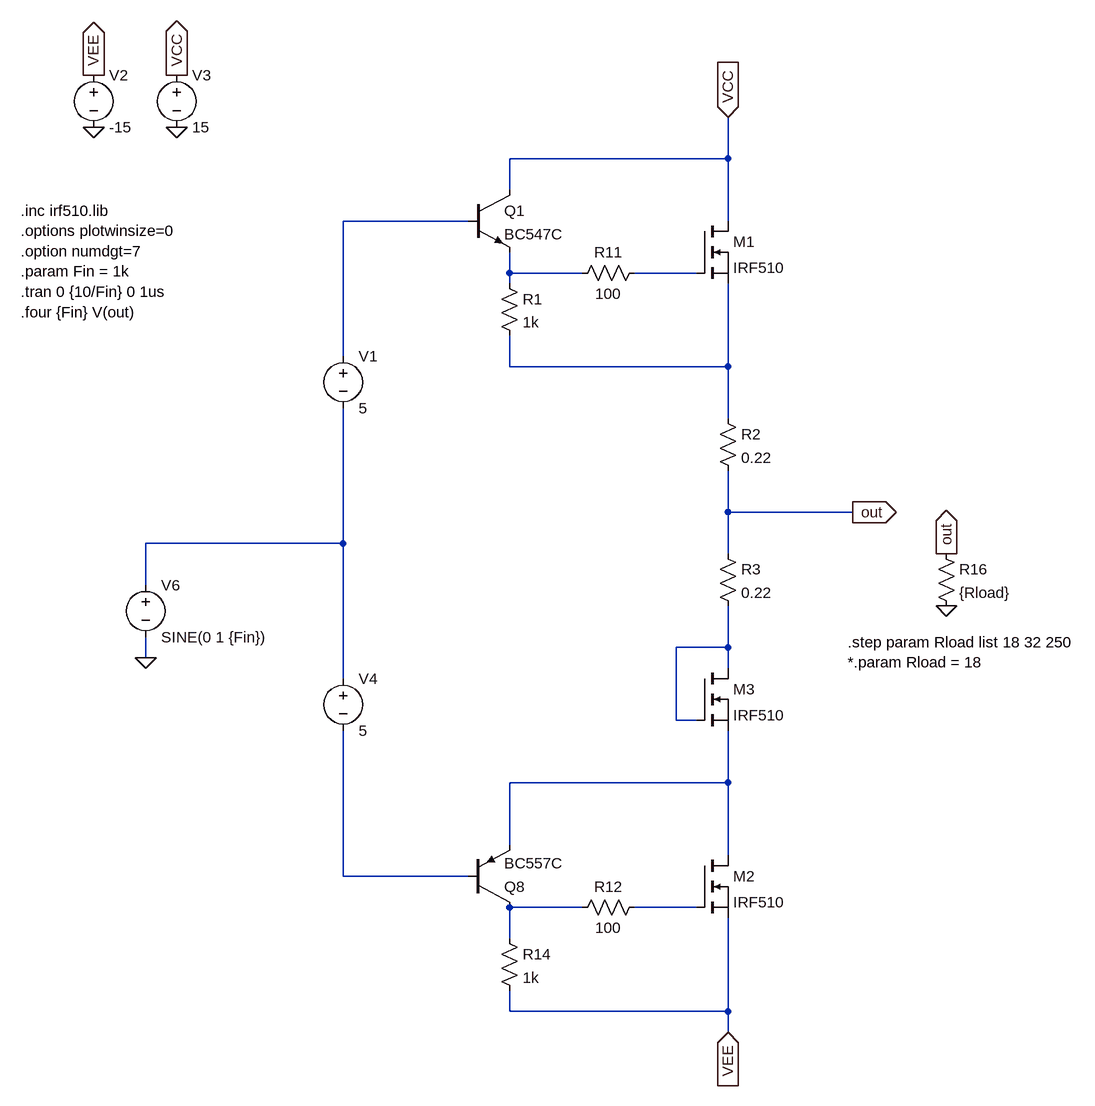
[diagram p0: schematic Symmetrical QC.asc]
Symmetrical QC.asc, the LTspice schematic file:
Version 4
SHEET 1 2384 1120
WIRE 32 -960 32 -1024
WIRE 32 -960 -304 -960
WIRE -304 -912 -304 -960
WIRE -368 -864 -560 -864
WIRE 32 -864 32 -960
WIRE -304 -784 -304 -816
WIRE -192 -784 -304 -784
WIRE -16 -784 -112 -784
WIRE -304 -768 -304 -784
WIRE -560 -656 -560 -864
WIRE -304 -640 -304 -688
WIRE 32 -640 32 -768
WIRE 32 -640 -304 -640
WIRE 32 -560 32 -640
WIRE 32 -416 32 -480
WIRE 224 -416 32 -416
WIRE -560 -368 -560 -576
WIRE -560 -368 -864 -368
WIRE 32 -352 32 -416
WIRE -864 -304 -864 -368
WIRE 32 -208 32 -272
WIRE 32 -208 -48 -208
WIRE -864 -192 -864 -224
WIRE 32 -176 32 -208
WIRE -560 -160 -560 -368
WIRE -48 -96 -48 -208
WIRE -16 -96 -48 -96
WIRE 32 0 32 -80
WIRE 32 0 -304 0
WIRE -304 96 -304 0
WIRE 32 112 32 0
WIRE -560 144 -560 -80
WIRE -368 144 -560 144
WIRE -192 192 -304 192
WIRE -16 192 -112 192
WIRE -304 240 -304 192
WIRE -304 352 -304 320
WIRE 32 352 32 208
WIRE 32 352 -304 352
WIRE 32 384 32 352
FLAG -944 -1008 0
FLAG -944 -1088 VEE
IOPIN -944 -1088 Out
FLAG -816 -1008 0
FLAG -816 -1088 VCC
IOPIN -816 -1088 Out
FLAG 368 -352 out
IOPIN 368 -352 Out
FLAG 368 -272 0
FLAG 224 -416 out
IOPIN 224 -416 Out
FLAG 32 -1024 VCC
IOPIN 32 -1024 In
FLAG 32 384 VEE
IOPIN 32 384 In
FLAG -864 -192 0
SYMBOL voltage -944 -1104 R0
SYMATTR InstName V2
SYMATTR Value -15
SYMBOL voltage -816 -1104 R0
SYMATTR InstName V3
SYMATTR Value 15
SYMBOL res 352 -368 R0
SYMATTR InstName R16
SYMATTR Value {Rload}
SYMBOL nmos -16 -864 R0
SYMATTR InstName M1
SYMATTR Value IRF510
SYMATTR Prefix X
SYMBOL nmos -16 112 R0
SYMATTR InstName M2
SYMATTR Value IRF510
SYMATTR Prefix X
SYMBOL res -320 224 R0
SYMATTR InstName R14
SYMATTR Value 1k
SYMBOL res -320 -784 R0
SYMATTR InstName R1
SYMATTR Value 1k
SYMBOL res 16 -576 R0
SYMATTR InstName R2
SYMATTR Value 0.22
SYMBOL res 16 -368 R0
SYMATTR InstName R3
SYMATTR Value 0.22
SYMBOL nmos -16 -176 R0
SYMATTR InstName M3
SYMATTR Value IRF510
SYMATTR Prefix X
SYMBOL voltage -864 -320 R0
SYMATTR InstName V6
SYMATTR Value SINE(0 1 {Fin})
SYMATTR Value2 AC 1
SYMBOL npn -368 -912 R0
SYMATTR InstName Q1
SYMATTR Value BC547C
SYMBOL pnp -368 192 M180
SYMATTR InstName Q8
SYMATTR Value BC557C
SYMBOL res -96 -800 R90
WINDOW 0 0 56 VBottom 2
WINDOW 3 32 56 VTop 2
SYMATTR InstName R11
SYMATTR Value 100
SYMBOL res -96 176 R90
WINDOW 0 0 56 VBottom 2
WINDOW 3 32 56 VTop 2
SYMATTR InstName R12
SYMATTR Value 100
SYMBOL voltage -560 -672 R0
SYMATTR InstName V1
SYMATTR Value 5
SYMBOL voltage -560 -176 R0
SYMATTR InstName V4
SYMATTR Value 5
TEXT -1056 -880 Left 2 !.inc irf510.lib\n.options plotwinsize=0\n.option numdgt=7\n.param Fin = 1k\n.tran 0 {10/Fin} 0 1us\n.four {Fin} V(out)
TEXT 216 -216 Left 2 !.step param Rload list 18 32 250\n*.param Rload = 18

The netlist it stands for:
* Symmetrical QC.asc
V2 VEE 0 -15
V3 VCC 0 15
R16 out 0 {Rload}
XM1 VCC N003 N004 IRF510  ; pins D G S
XM2 N007 N010 VEE IRF510  ; pins D G S
R14 N009 VEE 1k
R1 N002 N004 1k
R2 N004 out 0.22
R3 out N006 0.22
XM3 N006 N006 N007 IRF510  ; pins D G S
V6 N005 0 SINE(0 1 {Fin}) AC 1
Q1 VCC N001 N002 0 BC547C
Q8 N009 N008 N007 0 BC557C
R11 N003 N002 100
R12 N010 N009 100
V1 N001 N005 5
V4 N005 N008 5
.model NPN NPN
.model PNP PNP
.lib standard.bjt
.inc irf510.lib
.options plotwinsize=0
.option numdgt=7
.param Fin = 1k
.tran 0 {10/Fin} 0 1us
.four {Fin} V(out)
.step param Rload list 18 32 250
*.param Rload = 18
.backanno
.end